# Altium schematic sheet Nucleo_connections.SchDoc
size A4; SheetNumber: 1; SheetTotal: 7
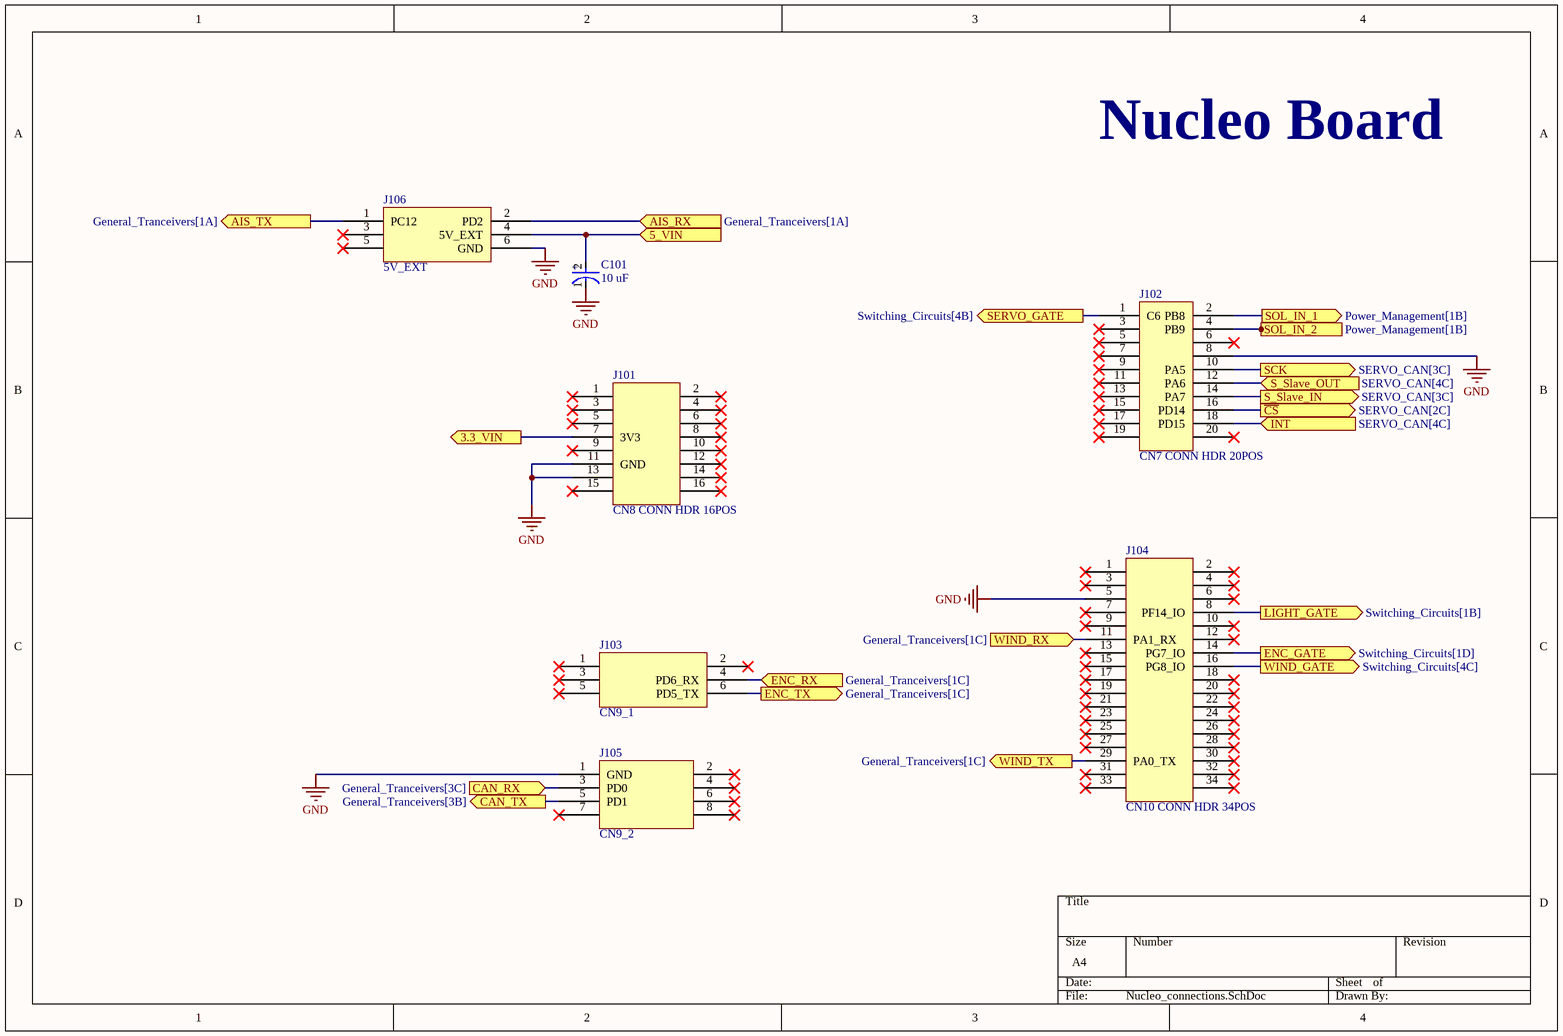
[diagram p0: Nucleo_connections.SchDoc]

## Parts
C101  10 uF  [FP-RAD-TH-D_10_0_5-L_20_2-MFG]
J101  CN8 CONN HDR 16POS  [CN8_8X2_PADS]
J102  CN7 CONN HDR 20POS  [CN7_10X2_PADS]
J103  CN9_1  [5V_EXT]
J104  CN10 CONN HDR 34POS  [CN10_17X2_PADS]
J105  CN9_2  [4x2]
J106  5V_EXT  [5V_EXT]

## Ports
3.3_VIN (out, see General_Tranceivers[1B], General_Tranceivers[1D], General_Tranceivers[2B], SERVO_CAN[1B], SERVO_CAN[2C]), 5_VIN (in, see Data_PWR_Connectors[1C], General_Tranceivers[2B], Power_Management[3A], Power_Management[4C], SERVO_CAN[1B]), AIS_RX (in, see General_Tranceivers[1A]), AIS_TX (out, see General_Tranceivers[1A]), CAN_RX (in, see General_Tranceivers[3C]), CAN_TX (out, see General_Tranceivers[3B]), ENC_GATE (out, see Switching_Circuits[1D]), ENC_RX (in, see General_Tranceivers[1C]), ENC_TX (out, see General_Tranceivers[1C]), INT (in, see SERVO_CAN[4C]), LIGHT_GATE (out, see Switching_Circuits[1B]), S_Slave_IN (out, see SERVO_CAN[3C]), S_Slave_OUT (in, see SERVO_CAN[4C]), SCK (out, see SERVO_CAN[3C]), SERVO_GATE (out, see Switching_Circuits[4B]), SOL_IN_1 (out, see Power_Management[1B]), SOL_IN_2 (out, see Power_Management[1B]), WIND_GATE (out, see Switching_Circuits[4C]), WIND_RX (in, see General_Tranceivers[1C]), WIND_TX (out, see General_Tranceivers[1C]), ~{CS} (out, see SERVO_CAN[2C])

## Nets
GND: C101.1(C) J101.11(GND) J101.13(GND) J102.8 J104.5 J105.1(GND) J106.6(GND)
3.3_VIN: J101.7(3V3) ; port 3.3_VIN
5_VIN: C101.2(A) J106.4(5V_EXT) ; port 5_VIN
AIS_RX: J106.2(PD2) ; port AIS_RX
AIS_TX: J106.1(PC12) ; port AIS_TX
~{CS}: J102.16(PD14) ; port ~{CS}
CAN_RX: J105.3(PD0) ; port CAN_RX
CAN_TX: J105.5(PD1) ; port CAN_TX
ENC_GATE: J104.14(PG7_IO) ; port ENC_GATE
ENC_RX: J103.4(PD6_RX) ; port ENC_RX
ENC_TX: J103.6(PD5_TX) ; port ENC_TX
INT: J102.18(PD15) ; port INT
LIGHT_GATE: J104.8(PF14_IO) ; port LIGHT_GATE
S_Slave_IN: J102.14(PA7) ; port S_Slave_IN
S_Slave_OUT: J102.12(PA6) ; port S_Slave_OUT
SCK: J102.10(PA5) ; port SCK
SERVO_GATE: J102.1(C6) ; port SERVO_GATE
SOL_IN_1: J102.2(PB8) ; port SOL_IN_1
SOL_IN_2: J102.4(PB9) ; port SOL_IN_2
WIND_GATE: J104.16(PG8_IO) ; port WIND_GATE
WIND_RX: J104.11(PA1_RX) ; port WIND_RX
WIND_TX: J104.29(PA0_TX) ; port WIND_TX

Not connected (* = marked no-connect by the designer): J101 1* 2* 3* 4* 5* 6* 8* 9* 10* 12* 14(PF3_IO)* 15(VIN)* 16(PF5_IO)*; J102 3* 5* 6* 7* 9* 11* 13* 15* 17* 19* 20*; J103 1(PA3_IO)* 2(PD2)* 3(PA2_IO)* 5(7)*; J104 1* 2* 3* 4* 6* 7* 9* 10* 12* 13* 15* 17* 18* 19* 20* 21* 22* 23* 24* 25* 26* 27* 28* 30* 31* 32* 33* 34*; J105 2* 4* 6* 7* 8*; J106 3(VDD)* 5(7)*

## Notes on the sheet
- Nucleo Board
- (in symbol CMP-05427-000989-1) +

## Library data of the parts
C101 = CMP-05427-000989-1: Aluminum Electrolytic Capacitors (Radial Lead Type) 10uF ±20% 350V; Ripple Current: 115mA; Dissipation Factor: 0.2%; Lead Diameter: 0.6mm; Lead/Base Style: Straight; Life (Hours): 2000Hour; Diameter: 10mm; Tolerance: 20%; RoHS Compliant: Yes; Voltage Rating: 350V; Construction: RADIAL; Radiation Hardening: No; Packaging: Bulk; Height: 20mm; Termination: Radial; Height - Seated (Max): 0.866inch; Voltage Rating (DC): 350V; Max Operating Temperature: 85°C; Lead Pitch: 5mm; Ripple Current (AC): 115mA; Length: 20mm; Case/Package: Radial; Mount: Through Hole; Series: M; Min Operating Temperature: -25°C; REACH SVHC: No SVHC; Capacitance: 10uF; Package Quantity: 200
J101 = CN8 CONN HDR 16POS: CN8 CONN HDR 16POS 0.1 STACK
J102 = CN7 CONN HDR 20POS: CN7 CONN HDR 20 POS  0.1 STACK
J103 = 5V_EXT
J104 = CN10 CONN HDR 34POS: CN10 CONN HDR 34 POS  0.1 STACK
J105 = 4x2